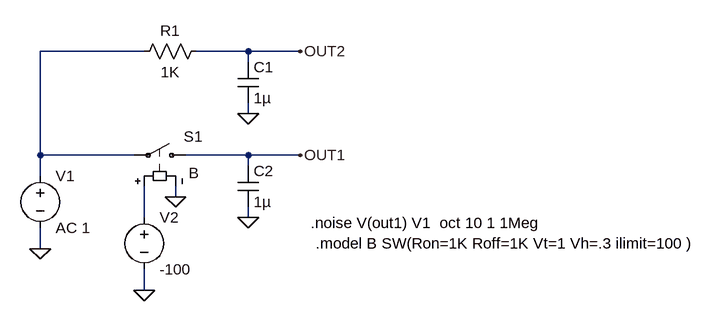
[diagram p0: schematic ac.asc]
ac.asc, the LTspice schematic file:
Version 4
SHEET 1 1276 680
WIRE -176 -352 -336 -352
WIRE -16 -352 -96 -352
WIRE 64 -352 -16 -352
WIRE -16 -336 -16 -352
WIRE -16 -256 -16 -272
WIRE -336 -192 -336 -352
WIRE -192 -192 -336 -192
WIRE -16 -192 -112 -192
WIRE 64 -192 -16 -192
WIRE -16 -176 -16 -192
WIRE -336 -160 -336 -192
WIRE -128 -128 -128 -144
WIRE -176 -96 -176 -144
WIRE -16 -96 -16 -112
WIRE -336 -48 -336 -80
WIRE -176 16 -176 -16
FLAG -336 -48 0
FLAG -16 -96 0
FLAG -128 -128 0
FLAG -16 -256 0
FLAG 64 -352 OUT2
FLAG 64 -192 OUT1
FLAG -176 16 0
SYMBOL sw -96 -192 M270
WINDOW 0 29 19 VLeft 2
WINDOW 3 -27 12 VLeft 2
SYMATTR InstName S1
SYMATTR Value B
SYMBOL voltage -336 -176 R0
SYMATTR InstName V1
SYMATTR Value AC 1
SYMBOL cap -32 -176 R0
SYMATTR InstName C2
SYMATTR Value 1µ
SYMBOL res -80 -368 R90
WINDOW 0 0 56 VBottom 2
WINDOW 3 32 56 VTop 2
SYMATTR InstName R1
SYMATTR Value 1K
SYMBOL cap -32 -336 R0
SYMATTR InstName C1
SYMATTR Value 1µ
SYMBOL voltage -176 -112 R0
SYMATTR InstName V2
SYMATTR Value -100
TEXT 88 -56 Left 2 !.model B SW(Ron=1K Roff=1K Vt=1 Vh=.3 ilimit=100 )
TEXT 80 -88 Left 2 !.noise V(out1) V1  oct 10 1 1Meg

The netlist it stands for:
* ac.asc
S1 OUT1 N001 N002 0 B
V1 N001 0 AC 1
C2 OUT1 0 1µ
R1 OUT2 N001 1K
C1 OUT2 0 1µ
V2 N002 0 -100
.model B SW(Ron=1K Roff=1K Vt=1 Vh=.3 ilimit=100 )
.noise V(out1) V1  oct 10 1 1Meg
.backanno
.end